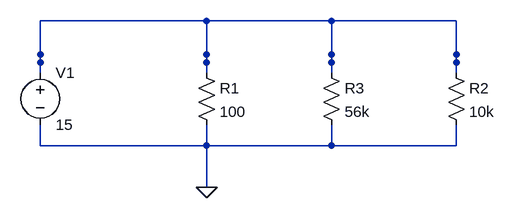
[diagram p0: schematic pannel1.asc]
pannel1.asc, the LTspice schematic file:
Version 4
SHEET 1 880 680
WIRE 512 400 512 372
WIRE 512 512 512 480
SYMBOL res 496 384 R0
SYMATTR InstName R1
SYMATTR Value 100
WIRE 896 400 896 372
WIRE 896 512 896 480
SYMBOL res 880 384 R0
SYMATTR InstName R2
SYMATTR Value 10k
WIRE 704 400 704 372
WIRE 704 512 704 480
SYMBOL res 688 384 R0
SYMATTR InstName R3
SYMATTR Value 56k
FLAG 512 576 0
WIRE 256 400 256 372
WIRE 256 512 256 480
SYMBOL voltage 256 384 R0
SYMATTR InstName V1
SYMATTR Value 15
WIRE 256 320 256 384
WIRE 256 320 320 320
WIRE 256 512 320 512
WIRE 512 320 512 384
WIRE 512 320 576 320
WIRE 448 320 512 320
WIRE 704 320 704 384
WIRE 704 320 768 320
WIRE 640 320 704 320
WIRE 896 320 896 384
WIRE 832 320 896 320
WIRE 832 512 896 512
WIRE 704 512 768 512
WIRE 640 512 704 512
WIRE 512 512 512 576
WIRE 512 512 576 512
WIRE 448 512 512 512
WIRE 320 512 384 512
WIRE 384 512 448 512
WIRE 384 320 448 320
WIRE 320 320 384 320
WIRE 576 320 640 320
WIRE 768 320 832 320
WIRE 768 512 832 512
WIRE 576 512 640 512

The netlist it stands for:
* pannel1.asc
R1 N001 0 100
R2 N001 0 10k
R3 N001 0 56k
V1 N001 0 15
.backanno
.end